# EAGLE schematic main (EAGLE 8.4.3)
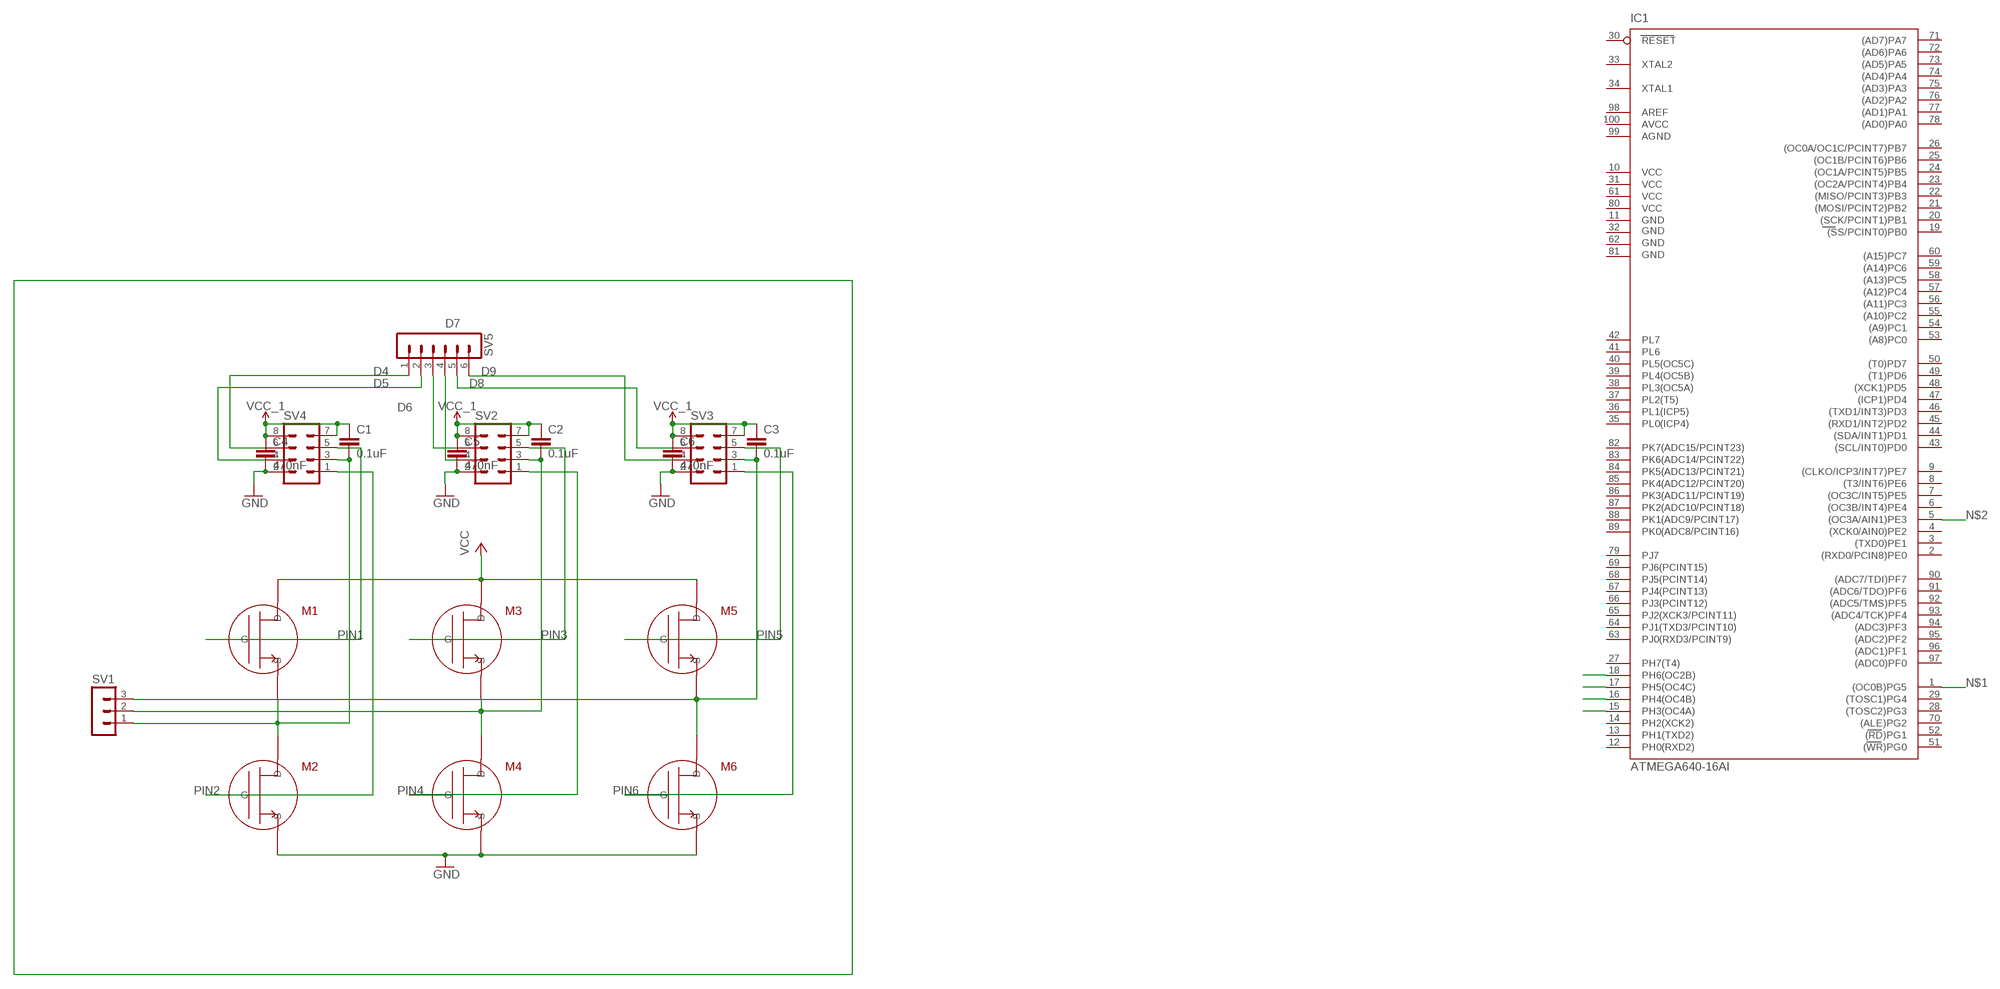
[diagram p0: schematic, sheet 1]

## Parts
C1  0.1uF  .1UF-CERCAP-08390  [0402-CAP]
C2  0.1uF  .1UF-CERCAP-08390  [0402-CAP]
C3  0.1uF  .1UF-CERCAP-08390  [0402-CAP]
C4  470nF  470NF-0402-16V-10%  [0402]
C5  470nF  470NF-0402-16V-10%  [0402]
C6  470nF  470NF-0402-16V-10%  [0402]
IC1  ATMEGA640-16AI  [TQFP100]
M1  FET_N  (no package)
M2  FET_N  (no package)
M3  FET_N  (no package)
M4  FET_N  (no package)
M5  FET_N  (no package)
M6  FET_N  (no package)
SV1  MA03-1  [MA03-1]
SV2  MA04-2  [MA04-2]
SV3  MA04-2  [MA04-2]
SV4  MA04-2  [MA04-2]
SV5  MA06-1  [MA06-1]

## Nets
D4: SV4.6 SV5.1
D5: SV4.4 SV5.2
D6: SV2.6 SV5.3
D7: SV2.4 SV5.4
D8: SV3.6 SV5.5
D9: SV3.4 SV5.6
GND: C4.2 C5.2 C6.2 M2.S M4.S M6.S SV2.2 SV3.2 SV4.2
N$1: IC1.1((OC0B)PG5)
N$2: IC1.5((OC3A/AIN1)PE3)
N$4: C1.2 M1.S M2.D SV1.1 SV4.3
N$5: C2.2 M3.S M4.D SV1.2 SV2.3
N$6: C3.2 M5.S M6.D SV1.3 SV3.3
N$7: IC1.15(PH3(OC4A))
N$8: IC1.16(PH4(OC4B))
N$9: IC1.17(PH5(OC4C))
N$10: IC1.18(PH6(OC2B))
PIN1: M1.G SV4.5
PIN2: M2.G SV4.1
PIN3: M3.G SV2.5
PIN4: M4.G SV2.1
PIN5: M5.G SV3.5
PIN6: M6.G SV3.1
VCC: M1.D M3.D M5.D
VCC_1: C1.1 C2.1 C3.1 C4.1 C5.1 C6.1 SV2.7 SV2.8 SV3.7 SV3.8 SV4.7 SV4.8
Unconnected: IC1.2((RXD0/PCIN8)PE0) IC1.3((TXD0)PE1) IC1.4((XCK0/AIN0)PE2) IC1.6((OC3B/INT4)PE4) IC1.7((OC3C/INT5)PE5) IC1.8((T3/INT6)PE6) IC1.9((CLKO/ICP3/INT7)PE7) IC1.12(PH0(RXD2)) IC1.13(PH1(TXD2)) IC1.14(PH2(XCK2)) IC1.19((SS/PCINT0)PB0) IC1.20((SCK/PCINT1)PB1) IC1.21((MOSI/PCINT2)PB2) IC1.22((MISO/PCINT3)PB3) IC1.23((OC2A/PCINT4)PB4) IC1.24((OC1A/PCINT5)PB5) IC1.25((OC1B/PCINT6)PB6) IC1.26((OC0A/OC1C/PCINT7)PB7) IC1.27(PH7(T4)) IC1.28((TOSC2)PG3) IC1.29((TOSC1)PG4) IC1.30(RESET) IC1.33(XTAL2) IC1.34(XTAL1) IC1.35(PL0(ICP4)) IC1.36(PL1(ICP5)) IC1.37(PL2(T5)) IC1.38(PL3(OC5A)) IC1.39(PL4(OC5B)) IC1.40(PL5(OC5C)) IC1.41(PL6) IC1.42(PL7) IC1.43((SCL/INT0)PD0) IC1.44((SDA/INT1)PD1) IC1.45((RXD1/INT2)PD2) IC1.46((TXD1/INT3)PD3) IC1.47((ICP1)PD4) IC1.48((XCK1)PD5) IC1.49((T1)PD6) IC1.50((T0)PD7) IC1.51((WR)PG0) IC1.52((RD)PG1) IC1.53((A8)PC0) IC1.54((A9)PC1) IC1.55((A10)PC2) IC1.56((A11)PC3) IC1.57((A12)PC4) IC1.58((A13)PC5) IC1.59((A14)PC6) IC1.60((A15)PC7) IC1.63(PJ0(RXD3/PCINT9)) IC1.64(PJ1(TXD3/PCINT10)) IC1.65(PJ2(XCK3/PCINT11)) IC1.66(PJ3(PCINT12)) IC1.67(PJ4(PCINT13)) IC1.68(PJ5(PCINT14)) IC1.69(PJ6(PCINT15)) IC1.70((ALE)PG2) IC1.71((AD7)PA7) IC1.72((AD6)PA6) IC1.73((AD5)PA5) IC1.74((AD4)PA4) IC1.75((AD3)PA3) IC1.76((AD2)PA2) IC1.77((AD1)PA1) IC1.78((AD0)PA0) IC1.79(PJ7) IC1.82(PK7(ADC15/PCINT23)) IC1.83(PK6(ADC14/PCINT22)) IC1.84(PK5(ADC13/PCINT21)) IC1.85(PK4(ADC12/PCINT20)) IC1.86(PK3(ADC11/PCINT19)) IC1.87(PK2(ADC10/PCINT18)) IC1.88(PK1(ADC9/PCINT17)) IC1.89(PK0(ADC8/PCINT16)) IC1.90((ADC7/TDI)PF7) IC1.91((ADC6/TDO)PF6) IC1.92((ADC5/TMS)PF5) IC1.93((ADC4/TCK)PF4) IC1.94((ADC3)PF3) IC1.95((ADC2)PF2) IC1.96((ADC1)PF1) IC1.97((ADC0)PF0) IC1.98(AREF)

## Power pins joined to a net without a drawn wire
AGND: IC1.99(AGND)
AVCC: IC1.100(AVCC)
GND: IC1.11(GND)
GND1: IC1.32(GND1)
GND2: IC1.62(GND2)
GND3: IC1.81(GND3)
VCC: IC1.10(VCC)
VCC1: IC1.31(VCC1)
VCC2: IC1.61(VCC2)
VCC3: IC1.80(VCC3)

## Library data of the parts
C1-C3 = SparkFun-Retired:.1UF-CER: .1uF ceramic SMT CAP-00810- 25V +80%/-20% (0603) CAP-08390- 100V 10% (0603) CAP-08604- 25V 5% (0603); PROD_ID: CAP-08390
C4-C6 = SparkFun-Capacitors:470NF: 0.47uF/470nF ceramic capacitors A capacitor is a passive two-terminal electrical component used to store electrical energy temporarily in an electric field.; PROD_ID: CAP-09041
IC1 = atmel-2005:ATMEGA*: MICROCONTROLLER 64/128/256 Kbytes FLASH 4 Kbytes EEPROM 8 Kbytes SRAM 86 General Purpose I/O pins 12-channels16-bit PWM 4 x Serial USARTs 16-channels 10-bit A/D
M1-M6 = ngspice-simulation:FET_N: N-Type MOS Field Effect Transistor (MOSFET)
SV1 = con-lstb:MA03-1: PIN HEADER; OC_FARNELL: unknown; OC_NEWARK: unknown
SV2-SV4 = con-lstb:MA04-2: PIN HEADER; OC_FARNELL: unknown; OC_NEWARK: unknown
SV5 = con-lstb:MA06-1: PIN HEADER; OC_FARNELL: unknown; OC_NEWARK: unknown